# Altium project Sub_A.PrjPcb
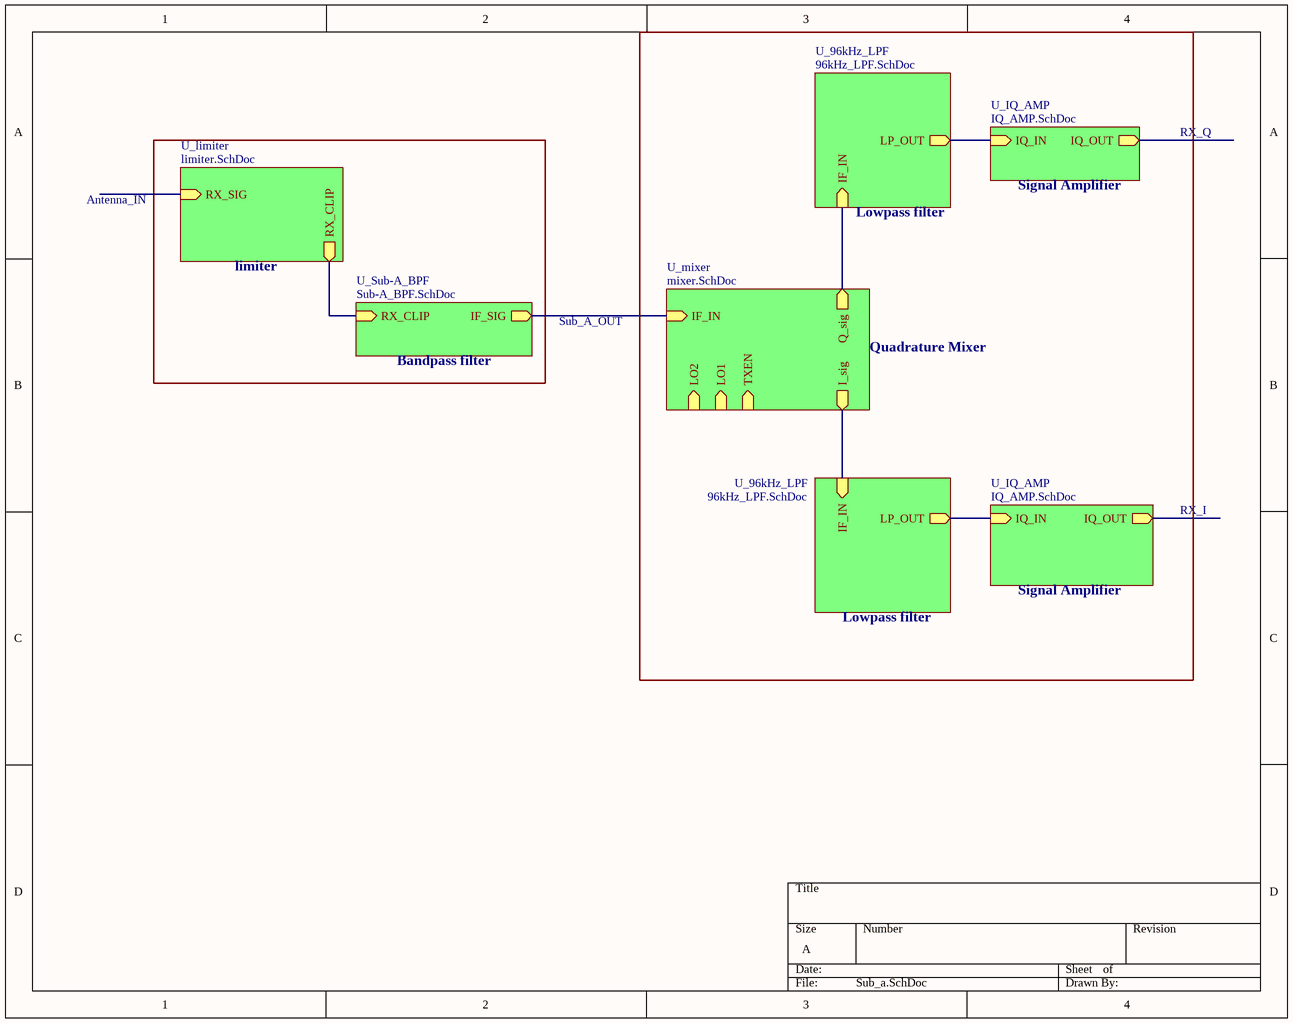
[diagram p0: Sub_a.SchDoc]
power net: 5v
6 sheets, 81 parts. Net scope: hierarchical (ports join the sheet entries above them; power ports are global).
Sheets:
  Sub_a.SchDoc
    U_limiter = limiter.SchDoc
    U_Sub-A_BPF = Sub-A_BPF.SchDoc
    U_96kHz_LPF = 96kHz_LPF.SchDoc
    U_96kHz_LPF = 96kHz_LPF.SchDoc
    U_IQ_AMP = IQ_AMP.SchDoc
    U_IQ_AMP = IQ_AMP.SchDoc
    U_mixer = mixer.SchDoc

## Sheet Sub_a.SchDoc
size A; SheetNumber: 1; SheetTotal: 6

### Sub-sheets
U_96kHz_LPF = 96kHz_LPF.SchDoc: IF_IN (in), LP_OUT (out)
U_96kHz_LPF = 96kHz_LPF.SchDoc: IF_IN (in), LP_OUT (out)
U_IQ_AMP = IQ_AMP.SchDoc: IQ_IN (in), IQ_OUT (out)
U_IQ_AMP = IQ_AMP.SchDoc: IQ_IN (in), IQ_OUT (out)
U_limiter = limiter.SchDoc: RX_SIG (in), RX_CLIP (out)
U_mixer = mixer.SchDoc: Q_sig (out), I_sig (out), TXEN (in), LO2 (in), LO1 (in), IF_IN (in)
U_Sub-A_BPF = Sub-A_BPF.SchDoc: IF_SIG (out), RX_CLIP (in)

### Nets
NetAR1_U_96kHz_LPF#1_6: sheet U_96kHz_LPF/LP_OUT, sheet U_IQ_AMP/IQ_IN
NetAR1_U_96kHz_LPF#2_6: sheet U_96kHz_LPF/LP_OUT, sheet U_IQ_AMP/IQ_IN
NetAR3_6: sheet U_96kHz_LPF/IF_IN, sheet U_mixer/Q_sig
NetAR4_6: sheet U_96kHz_LPF/IF_IN, sheet U_mixer/I_sig
NetC1_2: sheet U_Sub-A_BPF/IF_SIG, sheet U_mixer/IF_IN
NetC2_2: sheet U_limiter/RX_CLIP, sheet U_Sub-A_BPF/RX_CLIP

### Notes on the sheet
- RX_Q
- Antenna_IN
- Lowpass filter
- Signal Amplifier
- limiter
- Bandpass filter
- Sub_A_OUT
- Quadrature Mixer
- RX_I

## Sheet limiter.SchDoc
size A; SheetNumber: 3; SheetTotal: 6
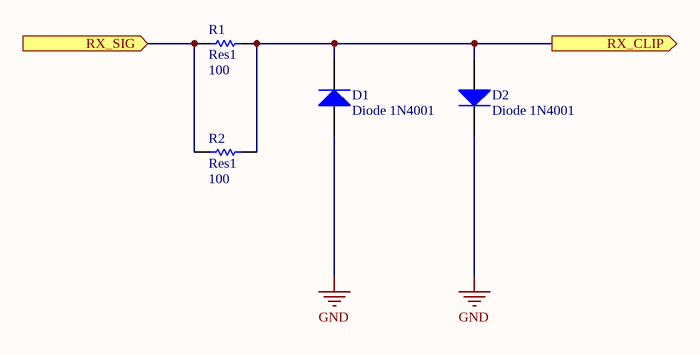
[diagram p1: limiter.SchDoc]

### Parts
D1  Diode 1N4001  [DO-41]
D2  Diode 1N4001  [DO-41]
R1  Res1  value 100  [AXIAL-0.1-RES]
R2  Res1  value 100  [AXIAL-0.1-RES]

### Ports
RX_CLIP (out), RX_SIG (in)

### Nets
GND: D1.1(A) D2.2(K)
NetC2_2: D1.2(K) D2.1(A) R1.2 R2.2 ; port RX_CLIP
NetR1_1: R1.1 R2.1 ; port RX_SIG

### Library data of the parts
D1 D2 = Diode 1N4001: 1 Amp General Purpose Rectifier; Published: 8-Jun-2000; LatestRevisionDate: 17-Jul-2002; LatestRevisionNote: Re-released for DXP Platform.; DatasheetVersion: 1998; PackageVersion: Aug-1999; PackageReference: DO-41; Publisher: Altium Limited; PackageDescription: Diode, Axial; Body 5.2 x 2.7 mm (LxDia. max), Lead Dia. 0.86 mm (max); Code_JEDEC: DO-204-AL; ComponentLink1Description: Manufacturer Link; ComponentLink1URL: http://www.fairchildsemi.com/; ComponentLink2Description: Datasheet; ComponentLink2URL: http://www.fairchildsemi.com/ds/1N%2F1N4001.pdf
R1 R2 = RES 100 OHM 5% 1/4W AXIAL: Resistor; Manufacturer Part Number: CFR-25JB-52-100R; Designator: R?; Power Rating: 1/4W; Tolerance: 0.05; Published: 8-Jun-2000; LatestRevisionDate: 17-Jul-2002; LatestRevisionNote: Re-released for DXP Platform.; Publisher: Altium Limited

## Sheet Sub-A_BPF.SchDoc
size A; SheetNumber: 2; SheetTotal: 6
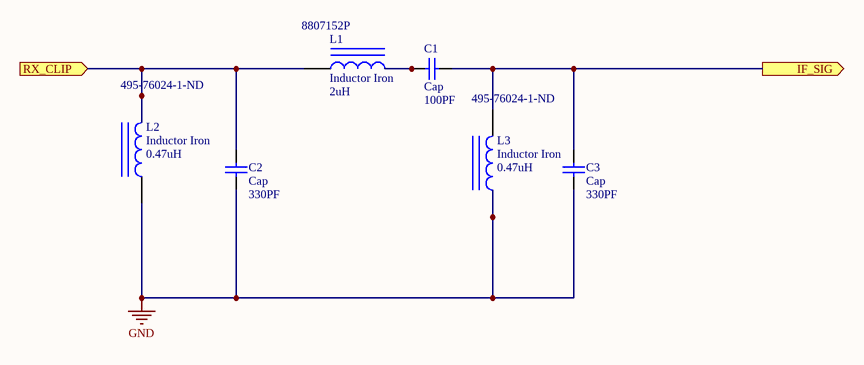
[diagram p2: Sub-A_BPF.SchDoc]

### Parts
C1  Cap  value 100PF  [RADIAL-0.1]
C2  Cap  value 330PF  [RADIAL-0.1]
C3  Cap  value 330PF  [RADIAL-0.1]
L1  Inductor Iron  value 2uH  Supplier Part Number 1: 8807152P  [AXIAL-0.9]
L2  Inductor Iron  value 0.47uH  Supplier Part Number 1: 495-76024-1-ND  [AXIAL-0.9]
L3  Inductor Iron  value 0.47uH  Supplier Part Number 1: 495-76024-1-ND  [AXIAL-0.9]

### Ports
IF_SIG (out), RX_CLIP (in)

### Nets
GND: C2.1 C3.1 L2.1 L3.1
NetC1_1: C1.1 L1.2
NetC1_2: C1.2 C3.2 L3.2 ; port IF_SIG
NetC2_2: C2.2 L1.1 L2.2 ; port RX_CLIP

### Library data of the parts
C1 = CAP CER 100PF 50V C0G/NP0 RADIAL: Capacitor; Manufacturer Part Number: K101K15C0GF53L2; Designator: C?; Voltage Rating: 50V; Published: 8-Jun-2000; LatestRevisionDate: 17-Jul-2002; LatestRevisionNote: Re-released for DXP Platform.; Publisher: Altium Limited
C2 C3 = CAP CER 330PF 50V X7R RADIAL: Capacitor; Manufacturer Part Number: K331K15X7RF53L2; Designator: C?; Voltage Rating: 50V; Published: 8-Jun-2000; LatestRevisionDate: 17-Jul-2002; LatestRevisionNote: Re-released for DXP Platform.; Publisher: Altium Limited
L1 = Inductor Iron: VHF-CHOKE                 2uH      4A; Manufacturer: TDK EPCOS; Manufacturer Part Number: B82132A5402M; Core Material: Ferrite; Self Resonant Frequency: 186MHz; Tolerance: 20%; DC Resistance (DCR): 20mR; Test Frequency: 1MHz; Lead/Base Style: Axial; Shielding: Unshielded; Q Factor: 0.02; Published: 24-Mar-1999; LatestRevisionDate: 17-Jul-2002; LatestRevisionNote: Re-released for DXP Platform.; PackageReference: AXIAL-0.9; Publisher: Altium Limited; PackageDescription: Axial Device, Thru-Hole; 2 Leads; 0.9 in Pin Spacing; Supplier 1: RSComponents; RoHS: Yes; Category: Fixed Inductors; Stock 1: 1; Pricing 1: 5=1.76700, 50=1.55200, 125=1.36100, 250=1.27000, 4000=1.20000 (USD); Mount: Through Hole; Case/Package: Axial; Min Operating Temperature: -55°C; Max Operating Temperature: 125°C; Packaging: Tape and Reel; Inductance: 2uH; Max DC Current: 4A; Termination: Axial; Current Rating: 4A; DC Current: 4A; Inductance Tolerance: 20%; Package Quantity: 2000; Resistor Type: Wirewound; Series: B82132; Diameter: 5.5mm; Length: 0.787inch; Height: 19mm; Military Standard: Not; REACH SVHC: No SVHC; ComponentLink1URL: https://datasheet.ciiva.com/3077/01950197-3077074.pdf?src-supplier=Avnet; ComponentLink1Description: https://datasheet.ciiva.com/3077/01950197-3077074.pdf?src-supplier=Avnet
L2 L3 = Inductor Iron: Fixed Ind 470NH 5A 27 Mohm Th; Manufacturer: TDK EPCOS; Manufacturer Part Number: B78108E1471M009; Published: 24-Mar-1999; LatestRevisionDate: 17-Jul-2002; LatestRevisionNote: Re-released for DXP Platform.; PackageReference: AXIAL-0.9; Publisher: Altium Limited; PackageDescription: Axial Device, Thru-Hole; 2 Leads; 0.9 in Pin Spacing; Supplier 1: Digi-Key; RoHS: Yes; Category: Fixed Inductors; Stock 1: 2681; Pricing 1: 1=0.46000, 10=0.40500, 25=0.35440, 50=0.30400, 100=0.27860, 250=0.25328, 500=0.23808, 1000=0.18236 (USD); RoHS Compliant: Yes

## Sheet 96kHz_LPF.SchDoc
size A; SheetNumber: 4; SheetTotal: 6
Used 2 times, as channels U_96kHz_LPF, U_96kHz_LPF. Parts and nets are listed once, with the designators drawn on the sheet.
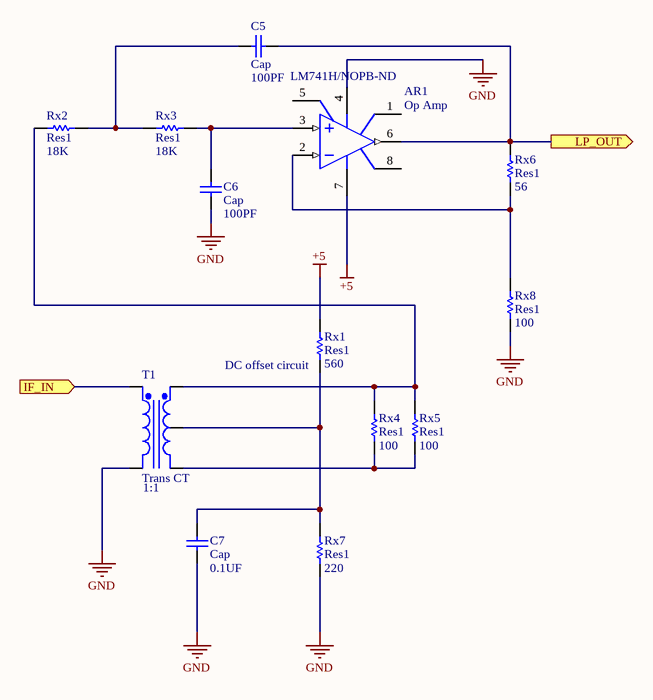
[diagram p3: 96kHz_LPF.SchDoc]

### Parts
AR1  Op Amp  Supplier Part Number 1: LM741H/NOPB-ND  [H-08A]
C5  Cap  value 100PF  [RADIAL-0.1]
C6  Cap  value 100PF  [RADIAL-0.1]
C7  Cap  value 0.1UF  [RADIAL-0.1]
Rx1  Res1  value 560  [AXIAL-0.1-RES]
Rx2  Res1  value 18K  [AXIAL-0.1-RES]
Rx3  Res1  value 18K  [AXIAL-0.1-RES]
Rx4  Res1  value 100  [AXIAL-0.1-RES]
Rx5  Res1  value 100  [AXIAL-0.1-RES]
Rx6  Res1  value 56  [AXIAL-0.1-RES]
Rx7  Res1  value 220  [AXIAL-0.1-RES]
Rx8  Res1  value 100  [AXIAL-0.1-RES]
T1  Trans CT  [BIFILAR-2402]

### Ports
IF_IN (in), LP_OUT (out)

### Nets
+5: AR1.7(V+) Rx1.2
GND: AR1.4(V-) C6.1 C7.1 Rx7.1 Rx8.1 T1.5(Pri-)
IF_IN: T1.4(Pri+) ; port IF_IN
LP_OUT: AR1.6(OUT) C5.2 Rx6.2 ; port LP_OUT
NetAR1_2: AR1.2(IN-) Rx6.1 Rx8.2
NetAR1_3: AR1.3(IN+) C6.2 Rx3.2
NetC5_1: C5.1 Rx2.2 Rx3.1
NetC7_2: C7.2 Rx1.1 Rx7.2 T1.2(SecCT)
NetRx2_1: Rx2.1 Rx4.2 Rx5.2 T1.1(Sec+)
NetRx4_1: Rx4.1 Rx5.1 T1.3(Sec-)

Not connected (* = marked no-connect by the designer): AR1 1(OS_NUL) 5(OS_NUL) 8(TAB)

### Channels
U_96kHz_LPF: designators end in _U_96kHz_LPF#1; ports IF_IN=NetAR3_6 LP_OUT=NetAR1_U_96kHz_LPF#1_6
U_96kHz_LPF: designators end in _U_96kHz_LPF#2; ports IF_IN=NetAR4_6 LP_OUT=NetAR1_U_96kHz_LPF#2_6

### Notes on the sheet
- (near Rx1) DC offset circuit
- (near T1) 1:1

### Library data of the parts
AR1 = Op Amp: FET Operational Amplifier; Published: 8-Jun-2000; LatestRevisionDate: 17-Jul-2002; LatestRevisionNote: Re-released for DXP Platform.; DatasheetVersion: REV. B; PackageVersion: 1990; PackageReference: H-08A; Publisher: Altium Limited; PackageDescription: Can; 8 Leads; Pin Circle Dia. 5.08 mm; Lead Dia. 0.53 mm (max); ComponentLink1Description: Manufacturer Link; ComponentLink1URL: http://www.analog.com/; Supplier 1: Digi-Key
C5 C6 = CAP CER 100PF 50V C0G/NP0 RADIAL: as C1 on sheet Sub-A_BPF; Published: 8-Jun-2000; LatestRevisionDate: 17-Jul-2002; LatestRevisionNote: Re-released for DXP Platform.; Publisher: Altium Limited
C7 = CAP CER 0.1UF 50V X7R RADIAL: Capacitor; Manufacturer Part Number: K104M15X7RF5TH5; Designator: C?; Voltage Rating: 50V; Published: 8-Jun-2000; LatestRevisionDate: 17-Jul-2002; LatestRevisionNote: Re-released for DXP Platform.; Publisher: Altium Limited
Rx1 = RES 560 OHM 5% 1/4W AXIAL: Resistor; Manufacturer Part Number: CFR-25JB-52-560R; Designator: R?; Power Rating: 1/4W; Tolerance: 0.05; Published: 8-Jun-2000; LatestRevisionDate: 17-Jul-2002; LatestRevisionNote: Re-released for DXP Platform.; Publisher: Altium Limited
Rx2 Rx3 = RES 18K OHM 5% 1/4W AXIAL: Resistor; Manufacturer Part Number: CFR-25JB-52-18K; Designator: R?; Power Rating: 1/4W; Tolerance: 0.05; Published: 8-Jun-2000; LatestRevisionDate: 17-Jul-2002; LatestRevisionNote: Re-released for DXP Platform.; Publisher: Altium Limited
Rx4 Rx5 Rx8 = RES 100 OHM 5% 1/4W AXIAL: as R1 on sheet limiter; Published: 8-Jun-2000; LatestRevisionDate: 17-Jul-2002; LatestRevisionNote: Re-released for DXP Platform.; Publisher: Altium Limited
Rx6 = RES 56 OHM 5% 1/4W AXIAL: Resistor; Manufacturer Part Number: CFR-25JB-52-56R; Designator: R?; Power Rating: 1/4W; Tolerance: 0.05; Published: 8-Jun-2000; LatestRevisionDate: 17-Jul-2002; LatestRevisionNote: Re-released for DXP Platform.; Publisher: Altium Limited
Rx7 = RES 220 OHM 5% 1/4W AXIAL: Resistor; Manufacturer Part Number: CFR-25JB-52-220R; Designator: R?; Power Rating: 1/4W; Tolerance: 0.05; Published: 8-Jun-2000; LatestRevisionDate: 17-Jul-2002; LatestRevisionNote: Re-released for DXP Platform.; Publisher: Altium Limited
T1 = Centre-tapped transformer wound on a binocular core: Center-Tapped Transformer (Coupled Inductor Model); Designator: T?; Published: 8-Jun-2000; LatestRevisionDate: 17-Jul-2002; LatestRevisionNote: Re-released for DXP Platform.; Publisher: Altium Limited

## Sheet IQ_AMP.SchDoc
size A; SheetNumber: 5; SheetTotal: 6
Used 2 times, as channels U_IQ_AMP, U_IQ_AMP. Parts and nets are listed once, with the designators drawn on the sheet.
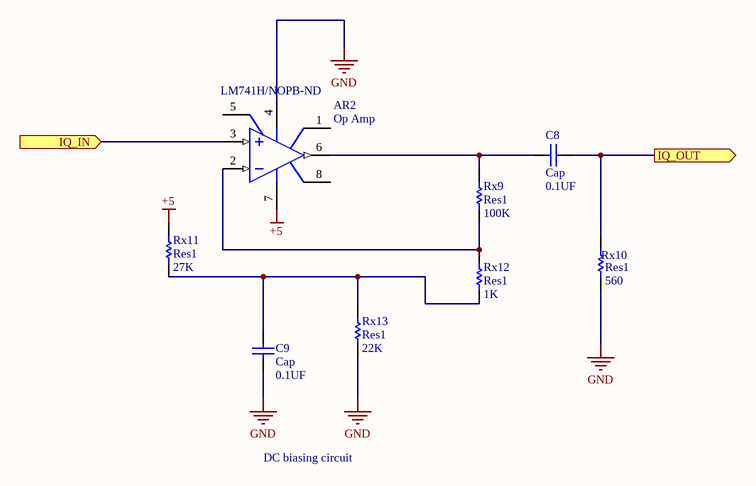
[diagram p4: IQ_AMP.SchDoc]

### Parts
AR2  Op Amp  Supplier Part Number 1: LM741H/NOPB-ND  [H-08A]
C8  Cap  value 0.1UF  [1206]
C9  Cap  value 0.1UF  [1206]
Rx9  Res1  value 100K  [AXIAL-0.1-RES]
Rx10  Res1  value 560  [AXIAL-0.1-RES]
Rx11  Res1  value 27K  [AXIAL-0.1-RES]
Rx12  Res1  value 1K  [AXIAL-0.1-RES]
Rx13  Res1  value 22K  [AXIAL-0.1-RES]

### Ports
IQ_IN (in), IQ_OUT (out)

### Nets
+5: AR2.7(V+) Rx11.2
GND: AR2.4(V-) C9.1 Rx10.1 Rx13.1
IQ_IN: AR2.3(IN+) ; port IQ_IN
IQ_OUT: C8.2 Rx10.2 ; port IQ_OUT
NetAR2_2: AR2.2(IN-) Rx9.1 Rx12.2
NetAR2_6: AR2.6(OUT) C8.1 Rx9.2
NetC9_2: C9.2 Rx11.1 Rx12.1 Rx13.2

Not connected (* = marked no-connect by the designer): AR2 1(OS_NUL) 5(OS_NUL) 8(TAB)

### Channels
U_IQ_AMP: designators end in _U_IQ_AMP#1; ports IQ_IN=NetAR1_U_96kHz_LPF#2_6 IQ_OUT=NetC8_U_IQ_AMP#1_2
U_IQ_AMP: designators end in _U_IQ_AMP#2; ports IQ_IN=NetAR1_U_96kHz_LPF#1_6 IQ_OUT=NetC8_U_IQ_AMP#2_2

### Notes on the sheet
- DC biasing circuit

### Library data of the parts
AR2 = Op Amp: FET Operational Amplifier; Published: 8-Jun-2000; LatestRevisionDate: 17-Jul-2002; LatestRevisionNote: Re-released for DXP Platform.; DatasheetVersion: REV. B; PackageVersion: 1990; PackageReference: H-08A; Publisher: Altium Limited; PackageDescription: Can; 8 Leads; Pin Circle Dia. 5.08 mm; Lead Dia. 0.53 mm (max); ComponentLink1Description: Manufacturer Link; ComponentLink1URL: http://www.analog.com/; Supplier 1: Digi-Key
C8 C9 = CAP CER 0.1UF 50V X7R 1206: Capacitor; Manufacturer Part Number: 885012208087; Designator: C?; Voltage Rating: 50V; Published: 8-Jun-2000; LatestRevisionDate: 17-Jul-2002; LatestRevisionNote: Re-released for DXP Platform.; Publisher: Altium Limited
Rx9 = RES 100K OHM 5% 1/4W AXIAL: Resistor; Manufacturer Part Number: CFR-25JB-52-100K; Designator: R?; Power Rating: 1/4W; Tolerance: 0.05; Published: 8-Jun-2000; LatestRevisionDate: 17-Jul-2002; LatestRevisionNote: Re-released for DXP Platform.; Publisher: Altium Limited
Rx10 = RES 560 OHM 5% 1/4W AXIAL: as Rx1 on sheet 96kHz_LPF; Published: 8-Jun-2000; LatestRevisionDate: 17-Jul-2002; LatestRevisionNote: Re-released for DXP Platform.; Publisher: Altium Limited
Rx11 = RES 27K OHM 5% 1/4W AXIAL: Resistor; Manufacturer Part Number: CFR-25JB-52-27K; Designator: R?; Power Rating: 1/4W; Tolerance: 0.05; Published: 8-Jun-2000; LatestRevisionDate: 17-Jul-2002; LatestRevisionNote: Re-released for DXP Platform.; Publisher: Altium Limited
Rx12 = RES 1K OHM 5% 1/4W AXIAL: Resistor; Manufacturer Part Number: CFR-25JB-52-1K; Designator: R?; Power Rating: 1/4W; Tolerance: 0.05; Published: 8-Jun-2000; LatestRevisionDate: 17-Jul-2002; LatestRevisionNote: Re-released for DXP Platform.; Publisher: Altium Limited
Rx13 = RES 22K OHM 5% 1/4W AXIAL: Resistor; Manufacturer Part Number: CFR-25JB-52-22K; Designator: R?; Power Rating: 1/4W; Tolerance: 0.05; Published: 8-Jun-2000; LatestRevisionDate: 17-Jul-2002; LatestRevisionNote: Re-released for DXP Platform.; Publisher: Altium Limited

## Sheet mixer.SchDoc
size A4; SheetNumber: 6; SheetTotal: 6
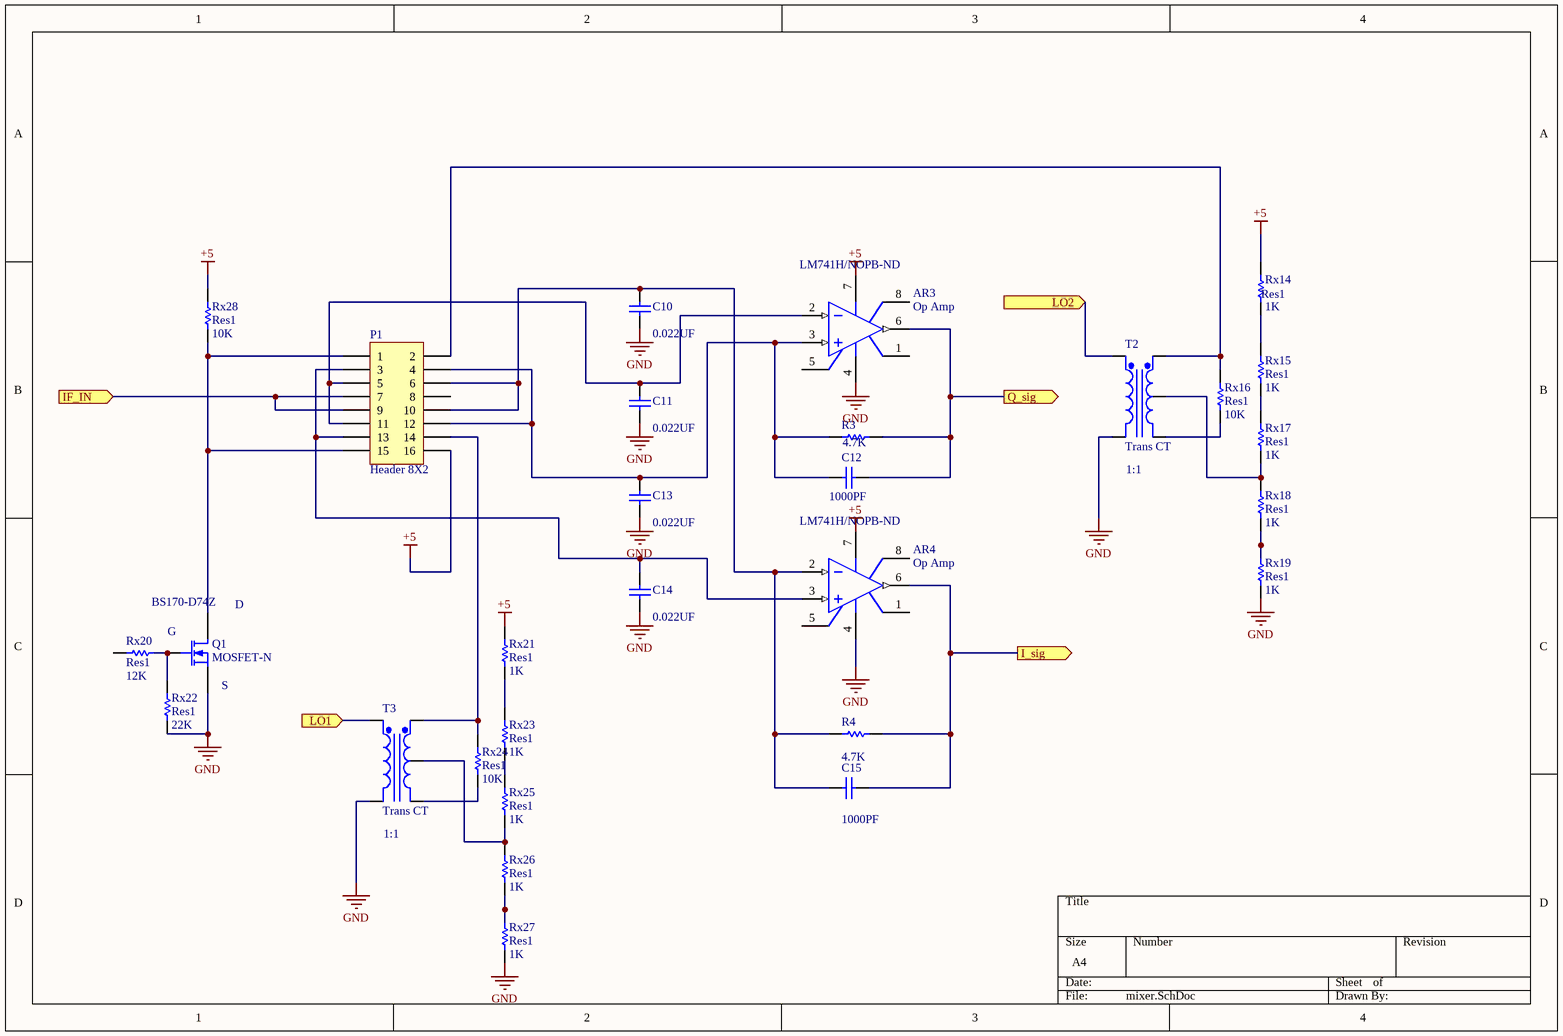
[diagram p5: mixer.SchDoc]

### Parts
AR3  Op Amp  Supplier Part Number 1: LM741H/NOPB-ND  [H-08A]
AR4  Op Amp  Supplier Part Number 1: LM741H/NOPB-ND  [H-08A]
C10  value 0.022UF  [RADIAL-0.1]
C11  value 0.022UF  [RADIAL-0.1]
C12  value 1000PF  [RADIAL-0.1]  (hidden comment: Cap)
C13  value 0.022UF  [RADIAL-0.1]  (hidden comment: Cap)
C14  value 0.022UF  [RADIAL-0.1]  (hidden comment: Cap)
C15  value 1000PF  [RADIAL-0.1]  (hidden comment: Cap)
P1  Header 8X2  [HDR2X8]
Q1  MOSFET-N  Supplier Part Number 1: BS170-D74Z  [E3]
R3  value 4.7K  [AXIAL-0.1-RES]  (hidden comment: Res1)
R4  value 4.7K  [AXIAL-0.1-RES]  (hidden comment: Res1)
Rx14  Res1  value 1K  [AXIAL-0.1-RES]
Rx15  Res1  value 1K  [AXIAL-0.1-RES]
Rx16  Res1  value 10K  [AXIAL-0.1-RES]
Rx17  Res1  value 1K  [AXIAL-0.1-RES]
Rx18  Res1  value 1K  [AXIAL-0.1-RES]
Rx19  Res1  value 1K  [AXIAL-0.1-RES]
Rx20  Res1  value 12K  [AXIAL-0.1-RES]
Rx21  Res1  value 1K  [AXIAL-0.1-RES]
Rx22  Res1  value 22K  [AXIAL-0.1-RES]
Rx23  Res1  value 1K  [AXIAL-0.1-RES]
Rx24  Res1  value 10K  [AXIAL-0.1-RES]
Rx25  Res1  value 1K  [AXIAL-0.1-RES]
Rx26  Res1  value 1K  [AXIAL-0.1-RES]
Rx27  Res1  value 1K  [AXIAL-0.1-RES]
Rx28  Res1  value 10K  [AXIAL-0.1-RES]
T2  Trans CT  [BIFILAR-2402]
T3  Trans CT  [BIFILAR-2402]

### Ports
I_sig (out), IF_IN (in), LO1 (in), LO2 (in), Q_sig (out)

### Nets
+5: AR3.7(V+) AR4.7(V+) P1.16 Rx14.2 Rx21.2 Rx28.2
GND: AR3.4(V-) AR4.4(V-) C10.1 C11.1 C13.1 C14.1 Q1.3(S) Rx19.1 Rx22.1 Rx27.1 T2.5(Pri-) T3.5(Pri-)
NetAR3_2: AR3.2(IN-) C11.2 P1.5 P1.11
NetAR3_3: AR3.3(IN+) C12.1 C13.2 P1.4 P1.12 R3.1
NetAR3_6: AR3.6(OUT) C12.2 R3.2 ; port Q_sig
NetAR4_2: AR4.2(IN-) C10.2 C15.1 P1.6 P1.10 R4.1
NetAR4_3: AR4.3(IN+) C14.2 P1.3 P1.13
NetAR4_6: AR4.6(OUT) C15.2 R4.2 ; port I_sig
NetC1_2: P1.7 P1.9 ; port IF_IN
NetP1_1: P1.1 P1.15 Q1.1(D) Rx28.1
NetP1_2: P1.2 Rx16.2 T2.1(Sec+)
NetP1_14: P1.14 Rx24.2 T3.1(Sec+)
NetQ1_2: Q1.2(G) Rx20.2 Rx22.2
NetRx14_1: Rx14.1 Rx15.2
NetRx15_1: Rx15.1 Rx17.2
NetRx16_1: Rx16.1 T2.3(Sec-)
NetRx17_1: Rx17.1 Rx18.2 T2.2(SecCT)
NetRx18_1: Rx18.1 Rx19.2
NetRx21_1: Rx21.1 Rx23.2
NetRx23_1: Rx23.1 Rx25.2
NetRx24_1: Rx24.1 T3.3(Sec-)
NetRx25_1: Rx25.1 Rx26.2 T3.2(SecCT)
NetRx26_1: Rx26.1 Rx27.2
NetT2_4: T2.4(Pri+) ; port LO2
NetT3_4: T3.4(Pri+) ; port LO1

Not connected (* = marked no-connect by the designer): AR3 1(OS_NUL) 5(OS_NUL) 8(TAB); AR4 1(OS_NUL) 5(OS_NUL) 8(TAB); P1 8; Rx20 1

### Notes on the sheet
- (near T2) 1:1
- (near Q1) G
- (near Q1) D
- (near Q1) S
- (near T3) 1:1

### Library data of the parts
AR3 AR4 = Op Amp: FET Operational Amplifier; Published: 8-Jun-2000; LatestRevisionDate: 17-Jul-2002; LatestRevisionNote: Re-released for DXP Platform.; DatasheetVersion: REV. B; PackageVersion: 1990; PackageReference: H-08A; Publisher: Altium Limited; PackageDescription: Can; 8 Leads; Pin Circle Dia. 5.08 mm; Lead Dia. 0.53 mm (max); ComponentLink1Description: Manufacturer Link; ComponentLink1URL: http://www.analog.com/; Supplier 1: Digi-Key
C10 C11 C13 C14 = CAP CER 0.022UF 50V X7R RADIAL: Capacitor; Manufacturer Part Number: C315C223K5R5TA7303; Designator: C?; Voltage Rating: 50V; Published: 8-Jun-2000; LatestRevisionDate: 17-Jul-2002; LatestRevisionNote: Re-released for DXP Platform.; Publisher: Altium Limited
C12 C15 = CAP CER 1000PF 50V Z5U RADIAL: Capacitor; Manufacturer Part Number: C315C102M5U5TA; Designator: C?; Voltage Rating: 50V; Published: 8-Jun-2000; LatestRevisionDate: 17-Jul-2002; LatestRevisionNote: Re-released for DXP Platform.; Publisher: Altium Limited
P1 = Header 8X2: Header, 8-Pin, Dual row; LatestRevisionDate: 17-Jul-2002; LatestRevisionNote: Re-released for DXP Platform.; Publisher: Altium Limited
Q1 = MOSFET-N: N-Channel MOSFET; Published: 8-Jun-2000; LatestRevisionDate: 17-Jul-2002; LatestRevisionNote: Re-released for DXP Platform.; PackageVersion: 1995/1996; PackageReference: E3; Publisher: Altium Limited; PackageDescription: TO, Flat Index; 3 In-Line, Axial Leads; Body Dia. 4.6mm; Lead Dia. 0.5 mm (max); Supplier 1: Avnet
R3 R4 = RES 4.7K OHM 5% 1/4W AXIAL: Resistor; Manufacturer Part Number: CFR-25JB-52-4K7; Designator: R?; Power Rating: 1/4W; Tolerance: 0.05; Published: 8-Jun-2000; LatestRevisionDate: 17-Jul-2002; LatestRevisionNote: Re-released for DXP Platform.; Publisher: Altium Limited
Rx14 Rx15 Rx17-Rx19 Rx21 Rx23 Rx25-Rx27 = RES 1K OHM 5% 1/4W AXIAL: as Rx12 on sheet IQ_AMP; Published: 8-Jun-2000; LatestRevisionDate: 17-Jul-2002; LatestRevisionNote: Re-released for DXP Platform.; Publisher: Altium Limited
Rx16 Rx24 Rx28 = RES 10K OHM 5% 1/4W AXIAL: Resistor; Manufacturer Part Number: CFR-25JB-52-10K; Designator: R?; Power Rating: 1/4W; Tolerance: 0.05; Published: 8-Jun-2000; LatestRevisionDate: 17-Jul-2002; LatestRevisionNote: Re-released for DXP Platform.; Publisher: Altium Limited
Rx20 = RES 12K OHM 5% 1/4W AXIAL: Resistor; Manufacturer Part Number: CFR-25JB-52-12K; Designator: R?; Power Rating: 1/4W; Tolerance: 0.05; Published: 8-Jun-2000; LatestRevisionDate: 17-Jul-2002; LatestRevisionNote: Re-released for DXP Platform.; Publisher: Altium Limited
Rx22 = RES 22K OHM 5% 1/4W AXIAL: as Rx13 on sheet IQ_AMP; Published: 8-Jun-2000; LatestRevisionDate: 17-Jul-2002; LatestRevisionNote: Re-released for DXP Platform.; Publisher: Altium Limited
T2 T3 = Centre-tapped transformer wound on a binocular core: as T1 on sheet 96kHz_LPF; Published: 8-Jun-2000; LatestRevisionDate: 17-Jul-2002; LatestRevisionNote: Re-released for DXP Platform.; Publisher: Altium Limited

## Nets that join several sheets
+5: U_96kHz_LPF (AR1_U_96kHz_LPF#1.7 Rx1_U_96kHz_LPF#1.2), U_96kHz_LPF (AR1_U_96kHz_LPF#2.7 Rx1_U_96kHz_LPF#2.2), U_IQ_AMP (AR2_U_IQ_AMP#1.7 Rx11_U_IQ_AMP#1.2), U_IQ_AMP (AR2_U_IQ_AMP#2.7 Rx11_U_IQ_AMP#2.2), mixer (6 pins)
GND: limiter (D1.1 D2.2), Sub-A_BPF (C2.1 C3.1 L2.1 L3.1), U_96kHz_LPF (6 pins), U_96kHz_LPF (6 pins), U_IQ_AMP (AR2_U_IQ_AMP#1.4 C9_U_IQ_AMP#1.1 Rx10_U_IQ_AMP#1.1 Rx13_U_IQ_AMP#1.1), U_IQ_AMP (AR2_U_IQ_AMP#2.4 C9_U_IQ_AMP#2.1 Rx10_U_IQ_AMP#2.1 Rx13_U_IQ_AMP#2.1), mixer (12 pins)
NetAR1_U_96kHz_LPF#1_6: U_96kHz_LPF (AR1_U_96kHz_LPF#1.6 C5_U_96kHz_LPF#1.2 Rx6_U_96kHz_LPF#1.2), U_IQ_AMP (AR2_U_IQ_AMP#2.3)
NetAR1_U_96kHz_LPF#2_6: U_96kHz_LPF (AR1_U_96kHz_LPF#2.6 C5_U_96kHz_LPF#2.2 Rx6_U_96kHz_LPF#2.2), U_IQ_AMP (AR2_U_IQ_AMP#1.3)
NetAR3_6: U_96kHz_LPF (T1_U_96kHz_LPF#1.4), mixer (AR3.6 C12.2 R3.2)
NetAR4_6: U_96kHz_LPF (T1_U_96kHz_LPF#2.4), mixer (AR4.6 C15.2 R4.2)
NetC1_2: Sub-A_BPF (C1.2 C3.2 L3.2), mixer (P1.7 P1.9)
NetC2_2: limiter (D1.2 D2.1 R1.2 R2.2), Sub-A_BPF (C2.2 L1.1 L2.2)